# EAGLE design motor_driver_module (EAGLE 6.5.0)
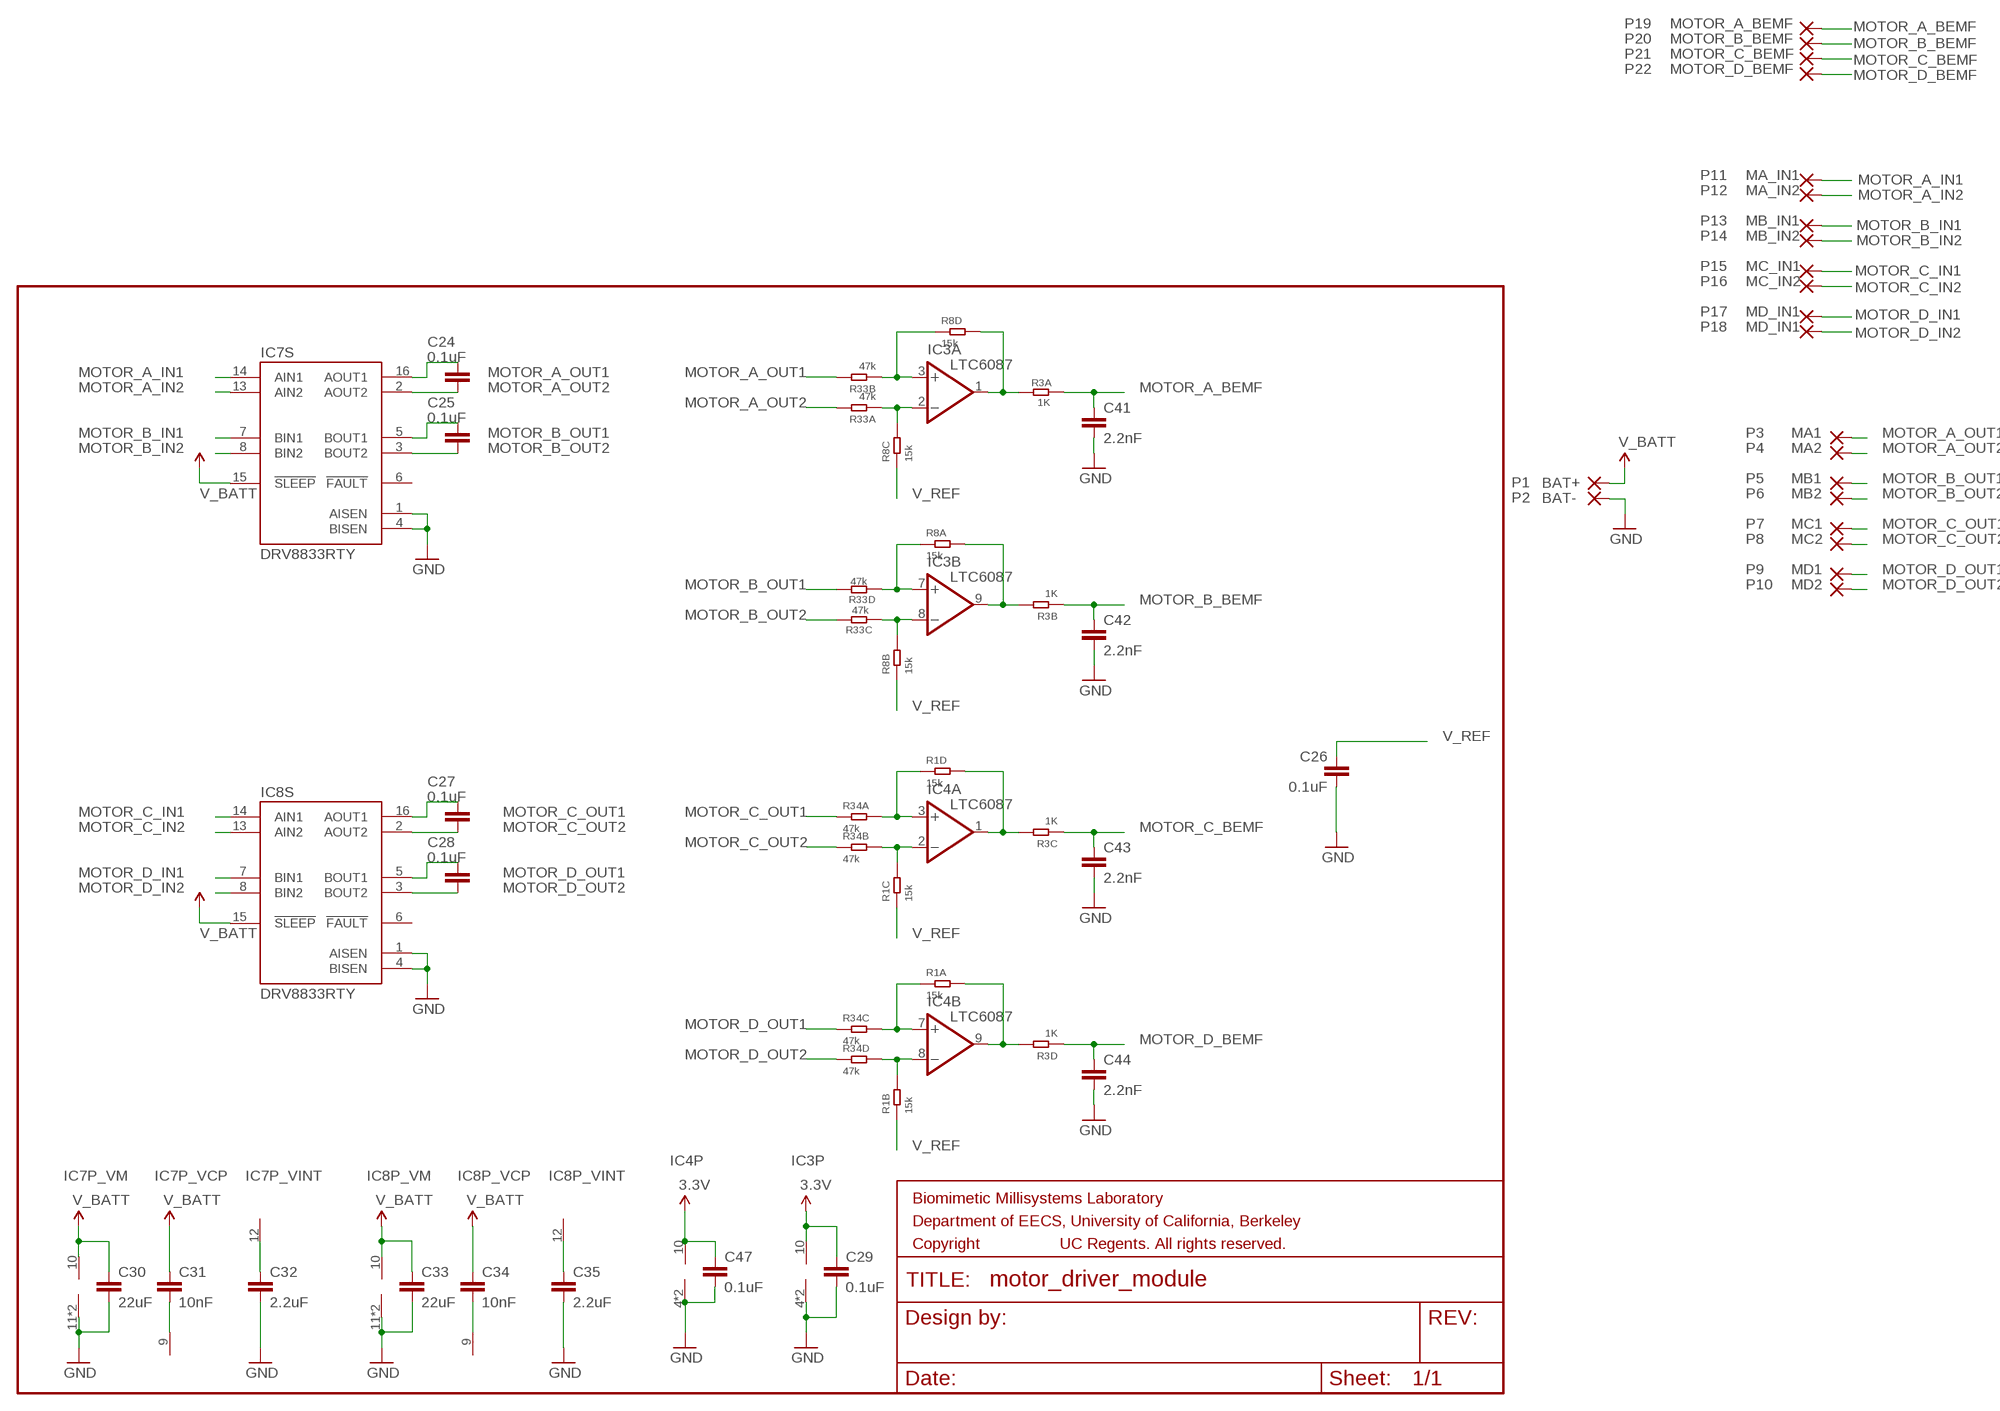
[diagram p0: schematic, sheet 1]
FRAME3 (FRAME-LETTER): SHEET_NAME: Motor Control

## Parts
C24  0.1uF  CAP0402-CAP  [0402-CAP]
C25  0.1uF  CAP0402-CAP  [0402-CAP]
C26  0.1uF  CAP0402-CAP  [0402-CAP]
C27  0.1uF  CAP0402-CAP  [0402-CAP]
C28  0.1uF  CAP0402-CAP  [0402-CAP]
C29  0.1uF  CAP0402-CAP  [0402-CAP]
C30  22uF  CAP0603-CAP  [0603-CAP]
C31  10nF  CAP0402-CAP  [0402-CAP]
C32  2.2uF  CAP0402-CAP  [0402-CAP]
C33  22uF  CAP0603-CAP  [0603-CAP]
C34  10nF  CAP0402-CAP  [0402-CAP]
C35  2.2uF  CAP0402-CAP  [0402-CAP]
C41  2.2nF  CAP0402-CAP  [0402-CAP]
C42  2.2nF  CAP0402-CAP  [0402-CAP]
C43  2.2nF  CAP0402-CAP  [0402-CAP]
C44  2.2nF  CAP0402-CAP  [0402-CAP]
C47  0.1uF  CAP0402-CAP  [0402-CAP]
IC3  LTC6087  [DFN-10]
IC4  LTC6087  [DFN-10]
IC7  DRV8833RTY  [S-PWQFN-N16]
IC8  DRV8833RTY  [S-PWQFN-N16]
P1  BAT+  SMD2  [SMD1,27-2,54]
P2  BAT-  SMD2  [SMD1,27-2,54]
P3  MA1  SMD2  [SMD1,27-2,54]
P4  MA2  SMD2  [SMD1,27-2,54]
P5  MB1  SMD2  [SMD1,27-2,54]
P6  MB2  SMD2  [SMD1,27-2,54]
P7  MC1  SMD2  [SMD1,27-2,54]
P8  MC2  SMD2  [SMD1,27-2,54]
P9  MD1  SMD2  [SMD1,27-2,54]
P10  MD2  SMD2  [SMD1,27-2,54]
P11  MA_IN1  SMD2  [SMD1,27-2,54]
P12  MA_IN2  SMD2  [SMD1,27-2,54]
P13  MB_IN1  SMD2  [SMD1,27-2,54]
P14  MB_IN2  SMD2  [SMD1,27-2,54]
P15  MC_IN1  SMD2  [SMD1,27-2,54]
P16  MC_IN2  SMD2  [SMD1,27-2,54]
P17  MD_IN1  SMD2  [SMD1,27-2,54]
P18  MD_IN1  SMD2  [SMD1,27-2,54]
P19  MOTOR_A_BEMF  SMD2  [SMD1,27-2,54]
P20  MOTOR_B_BEMF  SMD2  [SMD1,27-2,54]
P21  MOTOR_C_BEMF  SMD2  [SMD1,27-2,54]
P22  MOTOR_D_BEMF  SMD2  [SMD1,27-2,54]
R1  15k  R-4R  [R1206-8]
R3  1K  R-4R  [R1206-8]
R8  15k  R-4R  [R1206-8]
R33  47k  R-4R  [R1206-8]
R34  47k  R-4R  [R1206-8]

## Nets
3.3V: C29.1 C47.1 IC3.10(P:V+) IC4.10(P:V+)
GND: C26.2 C29.2 C30.2 C32.2 C33.2 C35.2 C41.2 C42.2 C43.2 C44.2 C47.2 IC3.4(P:V-) IC3.PAD(P:V-) IC4.4(P:V-) IC4.PAD(P:V-) IC7.1(S:AISEN) IC7.4(S:BISEN) IC7.11(P_VM:V-) IC7.PPAD(P_VM:V-) IC8.1(S:AISEN) IC8.4(S:BISEN) IC8.11(P_VM:V-) IC8.PPAD(P_VM:V-) P2.1(P)
MOTOR_A_BEMF: C41.1 P19.1(P) R3.1
MOTOR_A_IN1: IC7.14(S:AIN1) P11.1(P)
MOTOR_A_IN2: IC7.13(S:AIN2) P12.1(P)
MOTOR_A_OUT1: C24.1 IC7.16(S:AOUT1) P3.1(P) R33.7
MOTOR_A_OUT2: C24.2 IC7.2(S:AOUT2) P4.1(P) R33.8
MOTOR_B_BEMF: C42.1 P20.1(P) R3.2
MOTOR_B_IN1: IC7.7(S:BIN1) P13.1(P)
MOTOR_B_IN2: IC7.8(S:BIN2) P14.1(P)
MOTOR_B_OUT1: C25.1 IC7.5(S:BOUT1) P5.1(P) R33.4
MOTOR_B_OUT2: C25.2 IC7.3(S:BOUT2) P6.1(P) R33.3
MOTOR_C_BEMF: C43.1 P21.1(P) R3.3
MOTOR_C_IN1: IC8.14(S:AIN1) P15.1(P)
MOTOR_C_IN2: IC8.13(S:AIN2) P16.1(P)
MOTOR_C_OUT1: C27.1 IC8.16(S:AOUT1) P7.1(P) R34.1
MOTOR_C_OUT2: C27.2 IC8.2(S:AOUT2) P8.1(P) R34.2
MOTOR_D_BEMF: C44.1 P22.1(P) R3.4
MOTOR_D_IN1: IC8.7(S:BIN1) P17.1(P)
MOTOR_D_IN2: IC8.8(S:BIN2) P18.1(P)
MOTOR_D_OUT1: C28.1 IC8.5(S:BOUT1) P9.1(P) R34.3
MOTOR_D_OUT2: C28.2 IC8.3(S:BOUT2) P10.1(P) R34.4
N$2: C31.2 IC7.9(P_VCP:V+)
N$18: C32.1 IC7.12(P_VINT:V-)
N$19: C34.2 IC8.9(P_VCP:V+)
N$20: C35.1 IC8.12(P_VINT:V-)
N$22: IC3.7(B:+IN) R8.1 R33.5
N$23: IC3.8(B:-IN) R8.7 R33.6
N$24: IC4.3(A:+IN) R1.4 R34.8
N$25: IC4.2(A:-IN) R1.6 R34.7
N$26: IC4.7(B:+IN) R1.1 R34.6
N$27: IC4.8(B:-IN) R1.7 R34.5
N$30: IC3.3(A:+IN) R8.4 R33.2
N$31: IC3.2(A:-IN) R8.6 R33.1
N$34: IC4.9(B:OUT) R1.8 R3.5
N$35: IC4.1(A:OUT) R1.5 R3.6
N$36: IC3.1(A:OUT) R3.8 R8.5
N$37: IC3.9(B:OUT) R3.7 R8.8
V_BATT: C30.1 C31.1 C33.1 C34.1 IC7.10(P_VM:V+) IC7.15(S:!SLEEP) IC8.10(P_VM:V+) IC8.15(S:!SLEEP) P1.1(P)
V_REF: C26.1 R1.2 R1.3 R8.2 R8.3
Unconnected: IC3.5 IC3.6 IC4.5 IC4.6 IC7.6(S:!FAULT) IC8.6(S:!FAULT)

## Library data of the parts
C24 C25 C27 C28 = biomimetic:CAP: Capacitor Standard 0603 ceramic capacitor, and 0.1" leaded capacitor.; TECHNOLOGY: CERAMIC; VOLTAGE: 10V
C26 C29 C30 C33 C41-C44 C47 = biomimetic:CAP: Capacitor Standard 0603 ceramic capacitor, and 0.1" leaded capacitor.
C31 C34 = biomimetic:CAP: Capacitor Standard 0603 ceramic capacitor, and 0.1" leaded capacitor.; DIELECTRIC: X7R; TECHNOLOGY: CERAMIC; VOLTAGE: 16V
C32 C35 = biomimetic:CAP: Capacitor Standard 0603 ceramic capacitor, and 0.1" leaded capacitor.; TECHNOLOGY: CERAMIC; VOLTAGE: 6.3V
IC3 IC4 = biomimetic:LTC6087
IC7 IC8 = biomimetic:DRV8833: TI DRV8833 1.5A Dual H-Bridge Motor Driver IC Digi-Key P/N: 296-29513-6-ND
P1-P22 = wirepad:SMD2: SMD PAD
R1 R3 R8 R33 R34 = OPL Eagle Library:R-4R*: Resistor Array

## Board
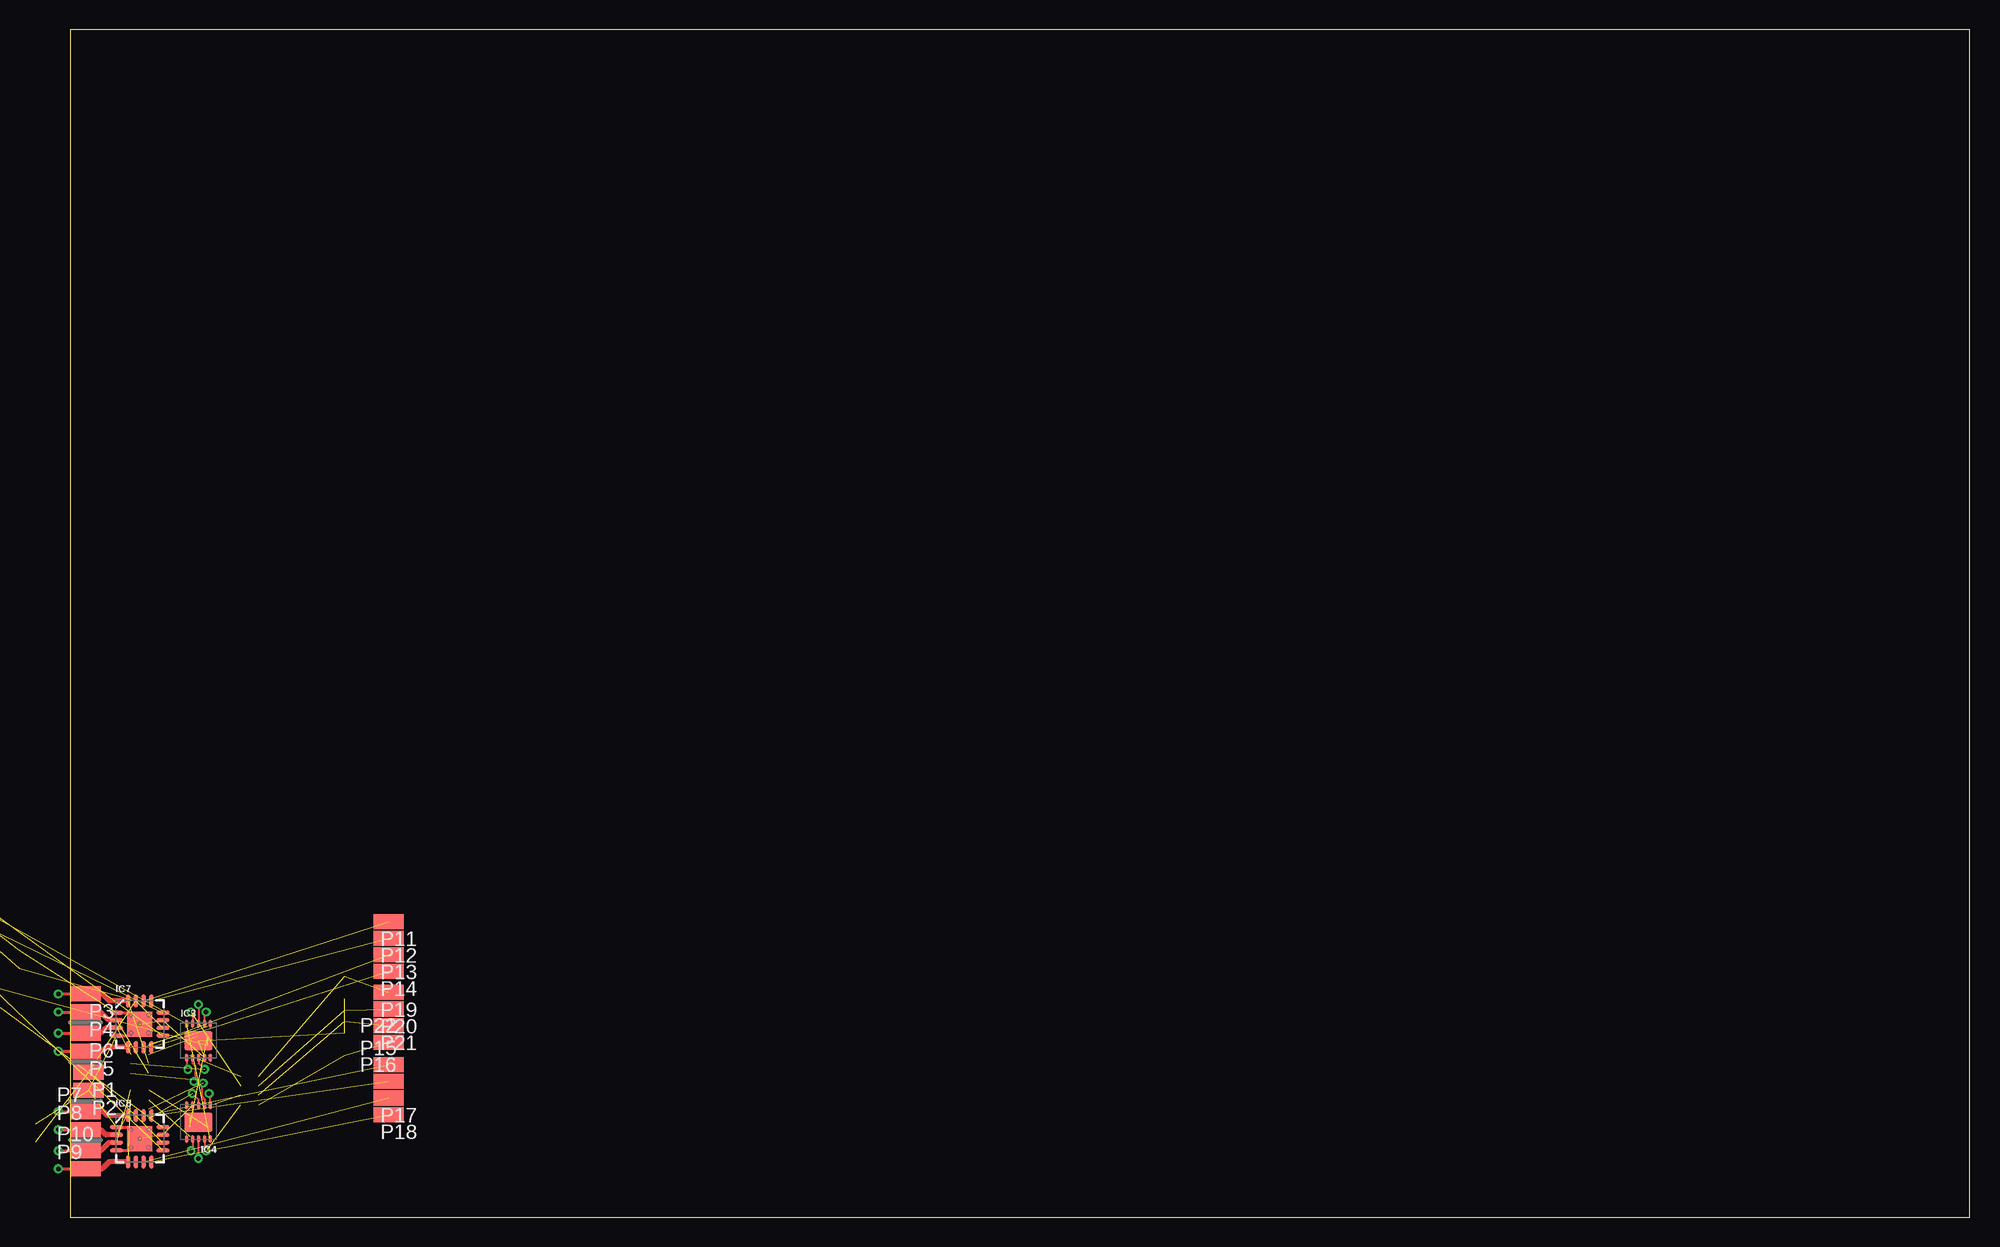
[diagram p1: board, top side]
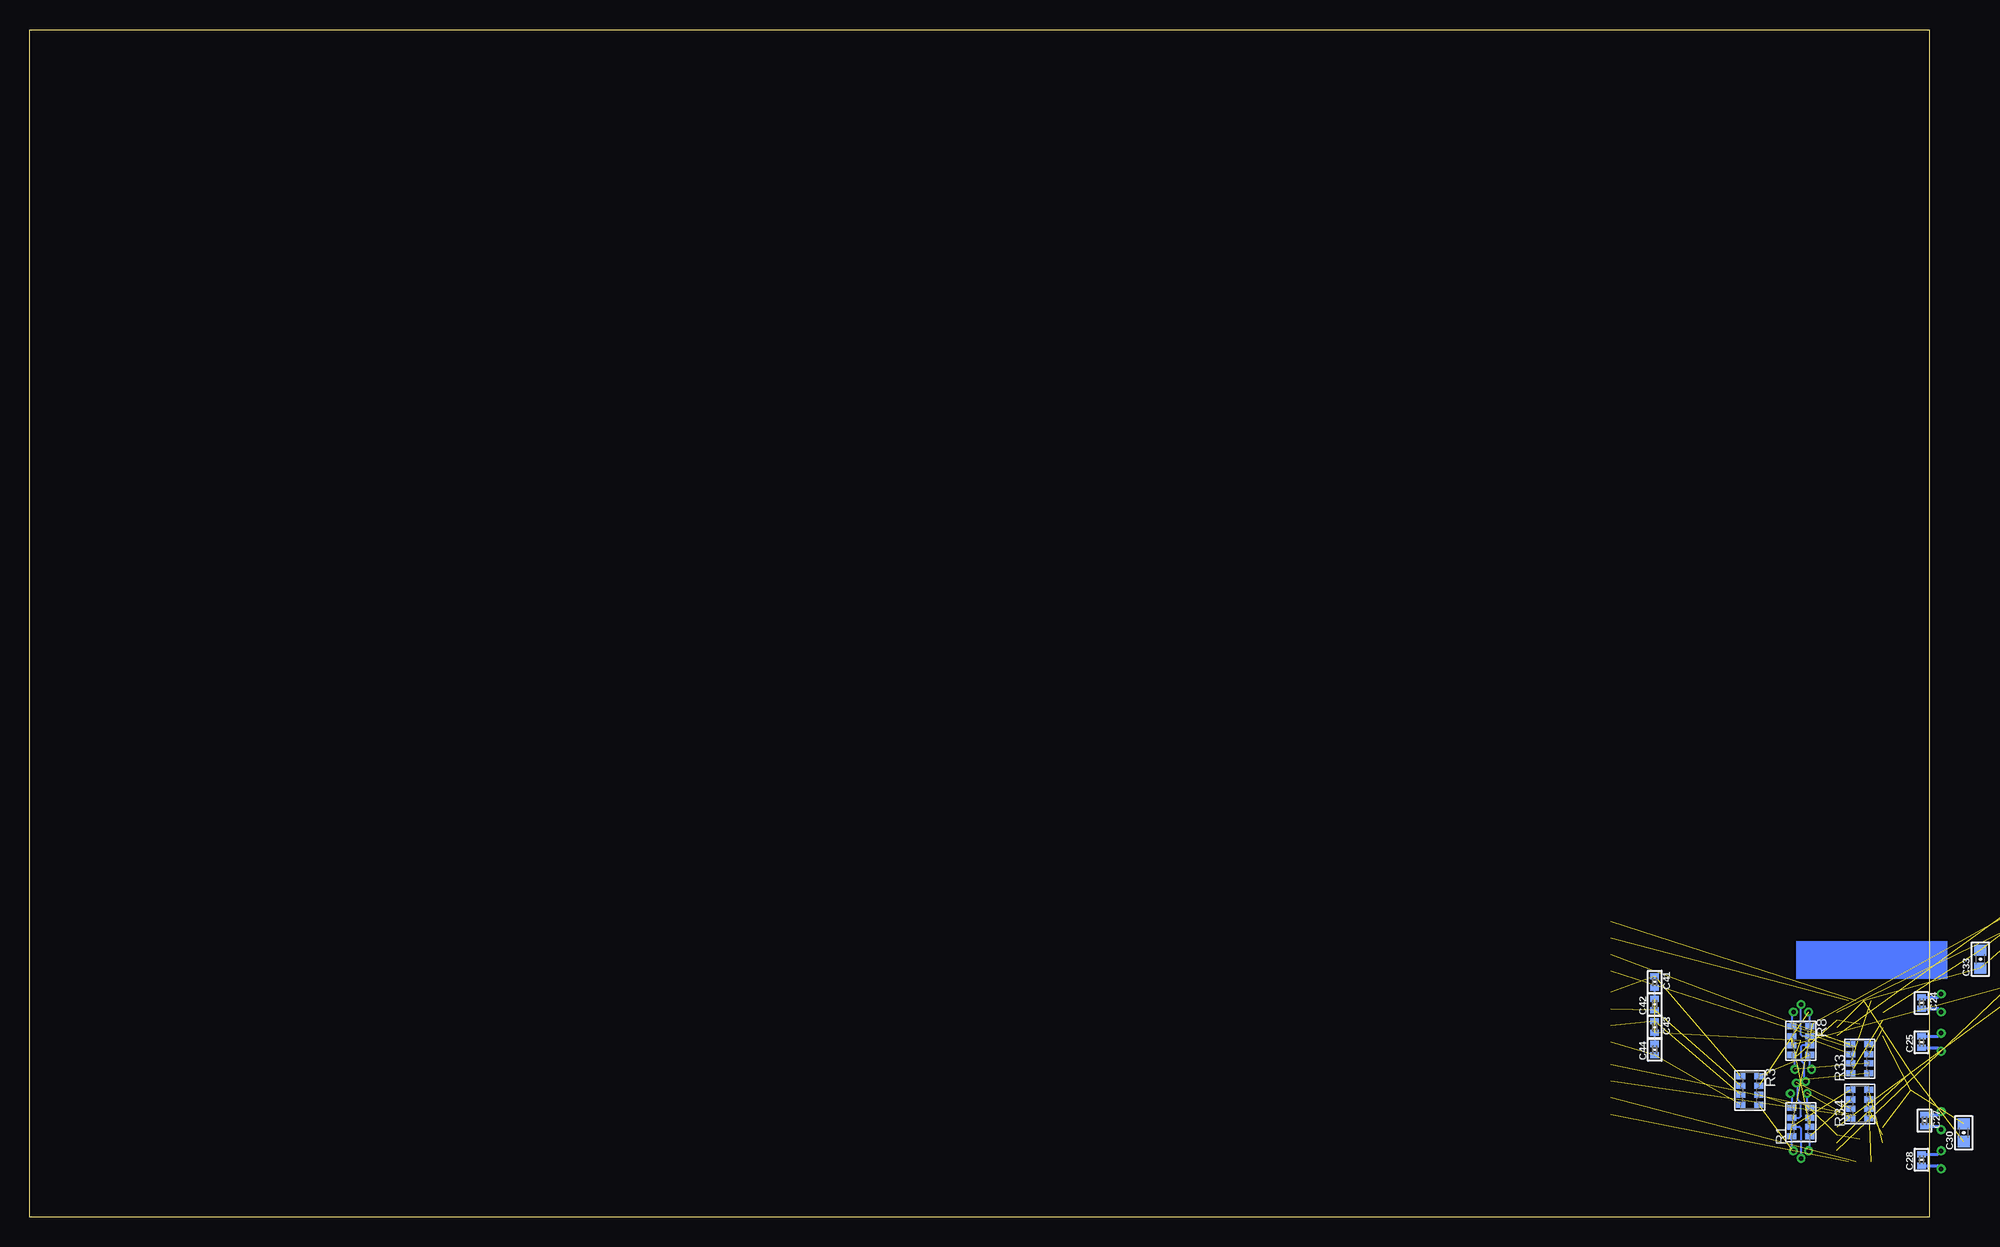
[diagram p2: board, bottom side, seen from below]

Size 160 x 100 mm. Coordinates in mm from the lower left corner, seen from the top.
Outline: 0,0 160,0 160,100 0,100 0,0
Copper layers (1*16): Top 2mil / dielectric 27mil / Bottom 2mil
Design rules "advancedcircuits-standard-biomimetic": minimum track width 5mil, minimum drill 10mil, track to track 5mil, track to pad 5mil, pad to pad 5mil, via to via 5mil, smd to smd 5mil, copper to edge 0.256540625mm, drill to drill 0.256540625mm, minimum pad ring 0.180340625mm, minimum via ring 0.180340625mm, stop-mask expansion 2mil, vias tented up to drill 0mil, thermal gap 10mil

### Footprints (pad centres in the part's own frame; a part is rotated, then mirrored left to right if it is on the bottom)
0402-CAP = smd 0.508 x 0.711: 1 -0.483,0; 2 0.483,0
0603-CAP = smd 0.94 x 1.016: 1 -0.749,0; 2 0.749,0
DFN-10 = smd 0.25 x 0.7: 1 -1,-1.425; 2 -0.5,-1.425; 3 0,-1.425; 4 0.5,-1.425; 5 1,-1.425; 6 1,1.425; 7 0.5,1.425; 8 0,1.425; 9 -0.5,1.425; 10 -1,1.425 | smd 2.38 x 1.65: PAD 0,0
S-PWQFN-N16 = smd 1.1 x 0.35: 1 -1.95,0.975; 2 -1.95,0.325; 3 -1.95,-0.325; 4 -1.95,-0.975; 9 1.95,-0.975; 10 1.95,-0.325; 11 1.95,0.325; 12 1.95,0.975 | smd 0.35 x 1.1: 5 -0.975,-1.95; 6 -0.325,-1.95; 7 0.325,-1.95; 8 0.975,-1.95; 13 0.975,1.95; 14 0.325,1.95; 15 -0.325,1.95; 16 -0.975,1.95 | smd 2.1 x 2.1: PPAD 0,0
SMD1,27-2,54 = smd 1.27 x 2.54: 1 0,0
R1206-8 = smd 0.508 x 0.762: 1 -1.206,-0.762; 2 -0.381,-0.762; 3 0.381,-0.762; 4 1.206,-0.762; 5 1.206,0.762; 6 0.381,0.762; 7 -0.381,0.762; 8 -1.206,0.762

### Placement (x,y rotation side)
C24  0.64,18.03 270 bottom
C25  0.64,14.73 90 bottom
C26  -27.94,25.4 0 top  (outside the outline)
C27  0.38,8.13 270 bottom
C28  0.64,4.83 90 bottom
C29  -15.24,30.48 0 top  (outside the outline)
C30  -2.92,7.11 90 bottom
C31  -19.05,34.29 0 top  (outside the outline)
C32  -19.05,30.48 0 top  (outside the outline)
C33  -4.32,21.72 90 bottom  (outside the outline)
C34  -22.86,34.29 0 top  (outside the outline)
C35  -22.86,30.48 0 top  (outside the outline)
C41  23.11,19.81 270 bottom
C42  23.11,17.91 90 bottom
C43  23.11,16 270 bottom
C44  23.11,14.1 90 bottom
C47  -15.24,34.29 0 top  (outside the outline)
IC3  10.79,14.86 0 top
IC4  10.79,8 180 top
IC7  5.84,16.26 0 top
IC8  5.84,6.6 0 top
P1  1.52,12.19 90 top
P2  1.52,10.67 90 top
P3  1.27,18.8 90 top
P4  1.27,17.27 90 top
P5  1.27,13.97 90 top
P6  1.27,15.49 90 top
P7  1.27,8.89 270 top
P8  1.27,7.37 270 top
P9  1.27,4.06 270 top
P10  1.27,5.59 270 top
P11  26.8,24.89 90 top
P12  26.8,23.5 90 top
P13  26.8,22.1 90 top
P14  26.8,20.7 90 top
P15  26.8,12.83 270 top
P16  26.8,11.43 270 top
P17  26.8,10.03 90 top
P18  26.8,8.64 90 top
P19  26.8,18.92 90 top
P20  26.8,17.53 90 top
P21  26.8,16.13 90 top
P22  26.8,14.73 270 top
R1  10.79,8 90 bottom
R3  15.11,10.67 270 bottom
R8  10.79,14.86 270 bottom
R33  5.84,13.34 90 bottom
R34  5.84,9.53 90 bottom

### Tracks (layer width: path | path; a pad name or v marks a point on that pad's centre or on a via)
3.3V  (3 unrouted)
GND  (16 unrouted)
  Top 0.152: IC4.4 10.29,8.5 IC4.PAD
  Top 0.254: IC8.1 4.87,7.58 IC8.PPAD 4.87,5.63 IC8.4 | IC7.4 4.87,15.28 IC7.PPAD 4.87,17.23 IC7.1
  Bottom 0.152: C42.2 C41.2 | C44.2 C43.2
MOTOR_A_BEMF  (2 unrouted)
MOTOR_A_IN1  (1 unrouted)
MOTOR_A_IN2  (1 unrouted)
MOTOR_A_OUT1  (via drill 0.38)  (1 unrouted)
  Top 0.254: v-1.02,18.8 P3.1
  Top 0.406: IC7.16 3.26,18.21 2.67,18.8 P3.1
  Bottom 0.254: C24.1 -0.74,18.52 v-1.02,18.8
MOTOR_A_OUT2  (via drill 0.38)  (1 unrouted)
  Top 0.254: v-1.02,17.27 P4.1
  Top 0.406: IC7.2 3.23,16.58 2.54,17.27 P4.1
  Bottom 0.254: C24.2 -0.74,17.55 v-1.02,17.27
MOTOR_B_BEMF  (2 unrouted)
MOTOR_B_IN1  (1 unrouted)
MOTOR_B_IN2  (1 unrouted)
MOTOR_B_OUT1  (via drill 0.38)  (1 unrouted)
  Top 0.254: v-1.02,13.97 P5.1
  Top 0.406: IC7.5 3,14.31 2.67,13.97 P5.1
  Bottom 0.254: C25.1 -0.74,14.25 v-1.02,13.97
MOTOR_B_OUT2  (via drill 0.38)  (1 unrouted)
  Top 0.254: v-1.02,15.49 P6.1
  Top 0.406: IC7.3 2.98,15.93 2.54,15.49 P6.1
  Bottom 0.254: C25.2 -0.74,15.21 v-1.02,15.49
MOTOR_C_BEMF  (2 unrouted)
MOTOR_C_IN1  (1 unrouted)
MOTOR_C_IN2  (1 unrouted)
MOTOR_C_OUT1  (via drill 0.38)  (1 unrouted)
  Top 0.254: v-1.02,8.89 P7.1
  Top 0.406: IC8.16 3.13,8.55 2.79,8.89 P7.1
  Bottom 0.254: C27.1 -0.74,8.61 v-1.02,8.89
MOTOR_C_OUT2  (via drill 0.38)  (1 unrouted)
  Top 0.254: v-1.02,7.37 P8.1
  Top 0.406: IC8.2 2.98,6.93 2.54,7.37 P8.1
  Bottom 0.254: C27.2 -0.74,7.64 v-1.02,7.37
MOTOR_D_BEMF  (2 unrouted)
MOTOR_D_IN1  (1 unrouted)
MOTOR_D_IN2  (1 unrouted)
MOTOR_D_OUT1  (via drill 0.38)  (1 unrouted)
  Top 0.254: v-1.02,4.06 P9.1
  Top 0.406: IC8.5 3.26,4.65 2.67,4.06 P9.1
  Bottom 0.254: C28.1 -0.74,4.34 v-1.02,4.06
MOTOR_D_OUT2  (via drill 0.38)  (1 unrouted)
  Top 0.254: v-1.02,5.59 P10.1
  Top 0.406: IC8.3 3.23,6.28 2.54,5.59 P10.1
  Bottom 0.254: C28.2 -0.74,5.31 v-1.02,5.59
N$2  (1 unrouted)
N$18  (1 unrouted)
N$19  (1 unrouted)
N$20  (1 unrouted)
N$22  (via drill 0.38)  (1 unrouted)
  Top 0.152: IC3.7 11.29,17.14 v11.43,17.27
  Bottom 0.152: v11.43,17.27 11.56,17.14 R8.1
N$23  (via drill 0.38)  (1 unrouted)
  Top 0.152: v10.79,17.91 IC3.8
  Bottom 0.152: R8.7 10.67,15.24 10.79,15.37 v10.79,17.91
N$24  (via drill 0.38)  (1 unrouted)
  Top 0.152: IC4.3 10.79,9.91 v10.29,10.41
  Bottom 0.152: v10.29,10.41 10.29,9.46 R1.4
N$25  (via drill 0.38)  (1 unrouted)
  Top 0.152: v11.18,11.3 11.05,11.18 11.05,10.16 11.3,9.91 11.3,9.43 IC4.2
  Bottom 0.152: R1.6 10.92,8.38 10.79,8.51 10.79,9.65 11.05,9.91 11.05,11.18 v11.18,11.3
N$26  (via drill 0.38)  (1 unrouted)
  Top 0.152: IC4.7 10.29,5.72 v10.16,5.59
  Bottom 0.152: v10.16,5.59 10.03,5.71 R1.1
N$27  (via drill 0.38)  (1 unrouted)
  Top 0.152: v10.79,4.95 IC4.8
  Bottom 0.152: R1.7 10.92,7.62 10.79,7.49 v10.79,4.95
N$30  (via drill 0.38)  (1 unrouted)
  Top 0.152: IC3.3 10.79,12.95 v11.3,12.45
  Bottom 0.152: v11.3,12.45 11.3,13.4 R8.4
N$31  (via drill 0.38)  (1 unrouted)
  Top 0.152: v10.41,11.43 10.54,11.56 10.54,12.7 10.29,12.95 IC3.2
  Bottom 0.152: R8.6 10.67,14.48 10.79,14.35 10.79,13.21 10.54,12.95 10.54,11.56 v10.41,11.43
N$34  (via drill 0.38)  (1 unrouted)
  Top 0.152: IC4.9 11.29,5.72 v11.43,5.59
  Bottom 0.152: v11.43,5.59 11.56,5.71 R1.8
N$35  (via drill 0.38)  (1 unrouted)
  Top 0.152: IC4.1 11.79,10.3 v11.68,10.41
  Bottom 0.152: v11.68,10.41 11.56,10.29 R1.5
N$36  (via drill 0.38)  (1 unrouted)
  Top 0.152: IC3.1 9.79,12.56 v9.91,12.45
  Bottom 0.152: v9.91,12.45 10.03,12.57 R8.5
N$37  (via drill 0.38)  (1 unrouted)
  Top 0.152: v10.16,17.27 10.29,17.14 10.29,16.29 IC3.9
  Bottom 0.152: R8.8 10.03,17.14 v10.16,17.27
V_BATT  (8 unrouted)
V_REF  (4 unrouted)
(copper drawn outside any net)
  shapes: Bottom area x1